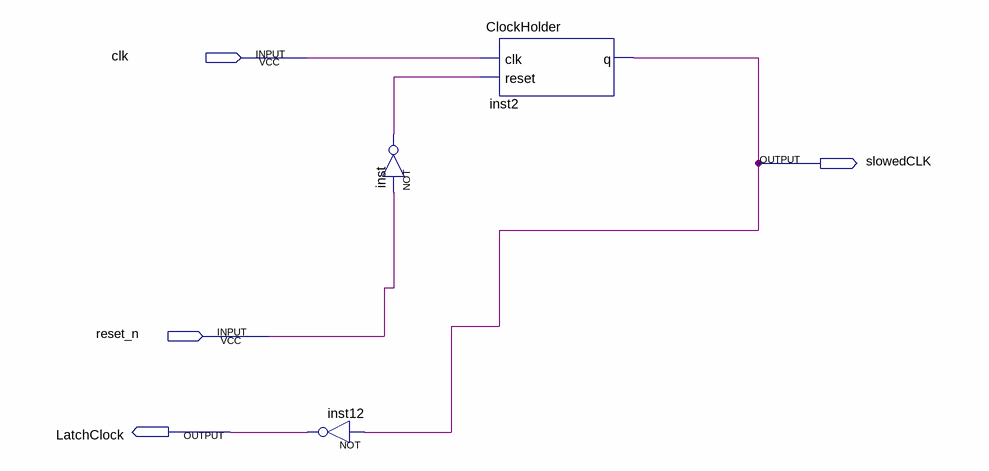
[diagram p0: schematic sheet]
// Quartus schematic halfNES.bdf as structural Verilog: 3 symbols, 4 pins
module halfNES (
  input  clk,
  input  reset_n,
  output slowedCLK,
  output LatchClock
);

  wire inst_out;

  not inst12 (LatchClock, slowedCLK);
  not inst (inst_out, reset_n);
  ClockHolder inst2 (.clk(clk), .reset(inst_out), .q(slowedCLK));
endmodule
